# Altium project LimeSDR_Mini_1v3.PrjPcb (part 2 of 4)

## Sheet 06_LMS7002M_Power.SchDoc: LMS7002M power supply
size A3 portrait; Organization: Lime Microsystems; Address1: Surrey Tech Centre; Address2: Guildford GU2 7YG; Address3: Surrey; Address4: United Kingdom; Revision: v1.3; SheetNumber: 6; SheetTotal: 9; PageSetup: Record=PageOptions|CenterHorizontal=True|CenterVertical=True|PrintScale=0.73|XCorrection=1.00|YCorrection=1.00|PrintKind=0|BorderSize=5000000|LeftOffset=0|BottomOffset=0|Orientation=1|PaperLength=2970|PaperWidth=2100|Scale=100|PaperSource=7|PrintQuality=-3|MediaType=1|DitherType=10|PrintScaleMode=1|PaperKind=A4|PaperIndex=9
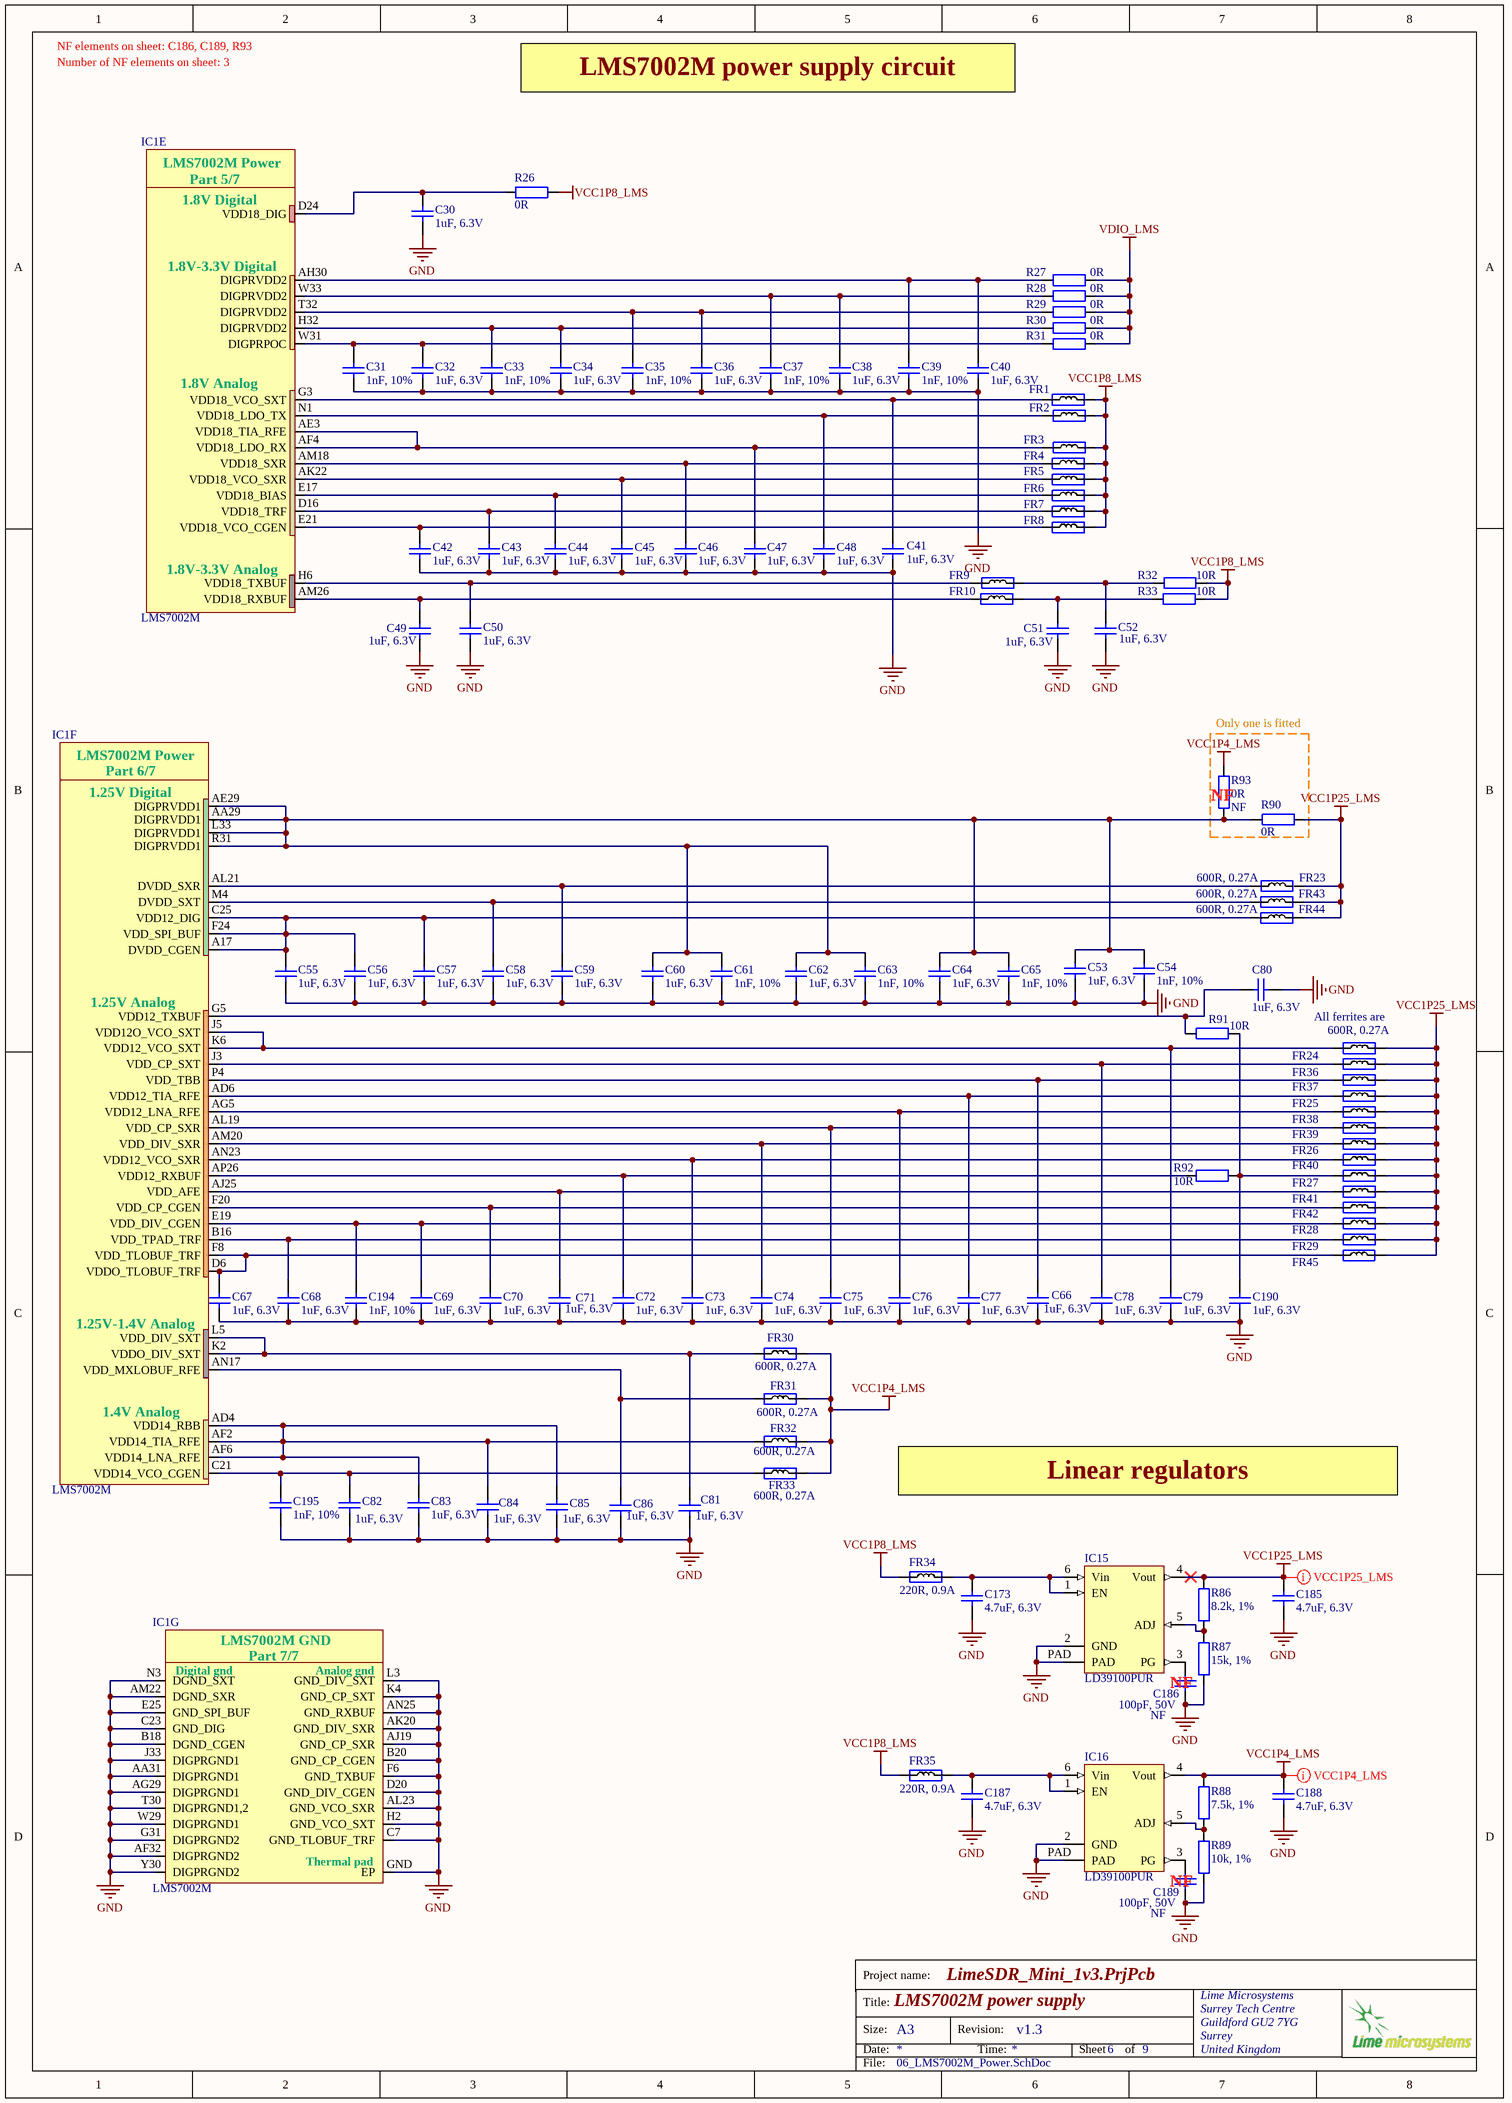
[diagram p5: 06_LMS7002M_Power.SchDoc]

### Parts
C30  1uF, 6.3V  [CAP0201]
C31  1nF, 10%  [CAP0201]
C32  1uF, 6.3V  [CAP0201]
C33  1nF, 10%  [CAP0201]
C34  1uF, 6.3V  [CAP0201]
C35  1nF, 10%  [CAP0201]
C36  1uF, 6.3V  [CAP0201]
C37  1nF, 10%  [CAP0201]
C38  1uF, 6.3V  [CAP0201]
C39  1nF, 10%  [CAP0201]
C40  1uF, 6.3V  [CAP0201]
C41  1uF, 6.3V  [CAP0201]
C42  1uF, 6.3V  [CAP0201]
C43  1uF, 6.3V  [CAP0201]
C44  1uF, 6.3V  [CAP0201]
C45  1uF, 6.3V  [CAP0201]
C46  1uF, 6.3V  [CAP0201]
C47  1uF, 6.3V  [CAP0201]
C48  1uF, 6.3V  [CAP0201]
C49  1uF, 6.3V  [CAP0201]
C50  1uF, 6.3V  [CAP0201]
C51  1uF, 6.3V  [CAP0201]
C52  1uF, 6.3V  [CAP0201]
C53  1uF, 6.3V  [CAP0201]
C54  1nF, 10%  [CAP0201]
C55  1uF, 6.3V  [CAP0201]
C56  1uF, 6.3V  [CAP0201]
C57  1uF, 6.3V  [CAP0201]
C58  1uF, 6.3V  [CAP0201]
C59  1uF, 6.3V  [CAP0201]
C60  1uF, 6.3V  [CAP0201]
C61  1nF, 10%  [CAP0201]
C62  1uF, 6.3V  [CAP0201]
C63  1nF, 10%  [CAP0201]
C64  1uF, 6.3V  [CAP0201]
C65  1nF, 10%  [CAP0201]
C66  1uF, 6.3V  [CAP0201]
C67  1uF, 6.3V  [CAP0201]
C68  1uF, 6.3V  [CAP0201]
C69  1uF, 6.3V  [CAP0201]
C70  1uF, 6.3V  [CAP0201]
C71  1uF, 6.3V  [CAP0201]
C72  1uF, 6.3V  [CAP0201]
C73  1uF, 6.3V  [CAP0201]
C74  1uF, 6.3V  [CAP0201]
C75  1uF, 6.3V  [CAP0201]
C76  1uF, 6.3V  [CAP0201]
C77  1uF, 6.3V  [CAP0201]
C78  1uF, 6.3V  [CAP0201]
C79  1uF, 6.3V  [CAP0201]
C80  1uF, 6.3V  [CAP0201]
C81  1uF, 6.3V  [CAP0201]
C82  1uF, 6.3V  [CAP0201]
C83  1uF, 6.3V  [CAP0201]
C84  1uF, 6.3V  [CAP0201]
C85  1uF, 6.3V  [CAP0201]
C86  1uF, 6.3V  [CAP0201]
C173  4.7uF, 6.3V  [CAP0402]
C185  4.7uF, 6.3V  [CAP0402]
C186  100pF, 50V  Assembly Info: NF  [CAP0402]
C187  4.7uF, 6.3V  [CAP0402]
C188  4.7uF, 6.3V  [CAP0402]
C189  100pF, 50V  Assembly Info: NF  [CAP0402]
C190  1uF, 6.3V  [CAP0201]
C194  1nF, 10%  [CAP0201]
C195  1nF, 10%  [CAP0201]
FR1  600R, 0.27A  [RES0201]  (value not drawn)
FR2  600R, 0.27A  [RES0201]  (value not drawn)
FR3  600R, 0.27A  [RES0201]  (value not drawn)
FR4  600R, 0.27A  [RES0201]  (value not drawn)
FR5  600R, 0.27A  [RES0201]  (value not drawn)
FR6  600R, 0.27A  [RES0201]  (value not drawn)
FR7  600R, 0.27A  [RES0201]  (value not drawn)
FR8  600R, 0.27A  [RES0201]  (value not drawn)
FR9  600R, 0.27A  [RES0201]  (value not drawn)
FR10  600R, 0.27A  [RES0201]  (value not drawn)
FR23  600R, 0.27A  [RES0201]
FR24  600R, 0.27A  [RES0201]
FR25  600R, 0.27A  [RES0201]  (value not drawn)
FR26  600R, 0.27A  [RES0201]  (value not drawn)
FR27  600R, 0.27A  [RES0201]  (value not drawn)
FR28  600R, 0.27A  [RES0201]  (value not drawn)
FR29  600R, 0.27A  [RES0201]  (value not drawn)
FR30  600R, 0.27A  [RES0201]
FR31  600R, 0.27A  [RES0201]
FR32  600R, 0.27A  [RES0201]
FR33  600R, 0.27A  [RES0201]
FR34  220R, 0.9A  [RES0402]
FR35  220R, 0.9A  [RES0402]
FR36  600R, 0.27A  [RES0201]  (value not drawn)
FR37  600R, 0.27A  [RES0201]  (value not drawn)
FR38  600R, 0.27A  [RES0201]  (value not drawn)
FR39  600R, 0.27A  [RES0201]  (value not drawn)
FR40  600R, 0.27A  [RES0201]  (value not drawn)
FR41  600R, 0.27A  [RES0201]  (value not drawn)
FR42  600R, 0.27A  [RES0201]  (value not drawn)
FR43  600R, 0.27A  [RES0201]
FR44  600R, 0.27A  [RES0201]
FR45  600R, 0.27A  [RES0201]  (value not drawn)
IC1  LMS7002M  [LMS7002M_v5]  (parts E,F,G of 7)
IC15  LD39100PUR  [LD39100PUR]
IC16  LD39100PUR  [LD39100PUR]
R26  0R  [RES0201]
R27  0R  [RES0402]
R28  0R  [RES0402]
R29  0R  [RES0402]
R30  0R  [RES0402]
R31  0R  [RES0402]
R32  10R  [RES0201]
R33  10R  [RES0201]
R86  8.2k, 1%  [RES0402]
R87  15k, 1%  [RES0402]
R88  7.5k, 1%  [RES0402]
R89  10k, 1%  [RES0402]
R90  0R  [RES0402]
R91  10R  [RES0201]
R92  10R  [RES0201]
R93  0R  Assembly Info: NF  [RES0402]

### Blocks framed on the sheet
Only one is fitted: R90 R93

### Nets
GND: C30.2 C31.2 C32.2 C33.2 C34.2 C35.2 C36.2 C37.2 C38.2 C39.2 C40.2 C41.2 C42.2 C43.2 C44.2 C45.2 C46.2 C47.2 C48.2 C49.2 C50.2 C51.2 C52.2 C53.2 C54.2 C55.2 C56.2 C57.2 C58.1 C59.2 C60.2 C61.2 C62.2 C63.2 C64.2 C65.2 C66.2 C67.2 C68.2 C69.2 C70.1 C71.2 C72.2 C73.2 C74.2 C75.2 C76.2 C77.1 C78.2 C79.1 C80.2 C81.2 C82.2 C83.2 C84.2 C85.2 C86.2 C173.1 C185.1 C186.1 C187.1 C188.1 C189.1 C190.1 C194.2 C195.2 IC1.AA31(DIGPRGND1) IC1.AF32(DIGPRGND2) IC1.AG29(DIGPRGND1) IC1.AJ19(GND_CP_SXR) IC1.AK20(GND_DIV_SXR) IC1.AL23(GND_VCO_SXR) IC1.AM22(DGND_SXR) IC1.AN25(GND_RXBUF) IC1.B18(DGND_CGEN) IC1.B20(GND_CP_CGEN) IC1.C7(GND_TLOBUF_TRF) IC1.C23(GND_DIG) IC1.D20(GND_DIV_CGEN) IC1.E25(GND_SPI_BUF) IC1.F6(GND_TXBUF) IC1.G31(DIGPRGND2) IC1.GND(EP) IC1.H2(GND_VCO_SXT) IC1.J33(DIGPRGND1) IC1.K4(GND_CP_SXT) IC1.L3(GND_DIV_SXT) IC1.N3(DGND_SXT) IC1.T30(DIGPRGND1,2) IC1.W29(DIGPRGND1) IC1.Y30(DIGPRGND2) IC15.2(GND) IC15.PAD IC16.2(GND) IC16.PAD R87.1 R89.1
VCC1P4_LMS: C188.2 FR30.2 FR31.2 FR32.2 FR33.2 IC16.4(Vout) R88.2 R93.1
VCC1P8_LMS: FR1.2 FR2.1 FR3.1 FR4.2 FR5.2 FR6.2 FR7.2 FR8.2 FR34.1 FR35.1 R26.2 R32.2 R33.1
VCC1P25_LMS: C185.2 FR23.2 FR24.2 FR25.2 FR26.2 FR27.2 FR28.2 FR29.2 FR36.2 FR37.2 FR38.2 FR39.2 FR40.2 FR41.2 FR42.2 FR43.2 FR44.2 FR45.2 IC15.4(Vout) R86.2 R90.1
VDIO_LMS: R27.1 R28.1 R29.1 R30.1 R31.1
NetC30_1: C30.1 IC1.D24(VDD18_DIG) R26.1
NetC31_1: C31.1 C32.1 IC1.W31(DIGPRPOC) R31.2
NetC33_1: C33.1 C34.1 IC1.H32(DIGPRVDD2) R30.2
NetC35_1: C35.1 C36.1 IC1.T32(DIGPRVDD2) R29.2
NetC37_1: C37.1 C38.1 IC1.W33(DIGPRVDD2) R28.2
NetC39_1: C39.1 C40.1 IC1.AH30(DIGPRVDD2) R27.2
NetC41_1: C41.1 FR1.1 IC1.G3(VDD18_VCO_SXT)
NetC42_1: C42.1 FR8.1 IC1.E21(VDD18_VCO_CGEN)
NetC43_1: C43.1 FR7.1 IC1.D16(VDD18_TRF)
NetC44_1: C44.1 FR6.1 IC1.E17(VDD18_BIAS)
NetC45_1: C45.1 FR5.1 IC1.AK22(VDD18_VCO_SXR)
NetC46_1: C46.1 FR4.1 IC1.AM18(VDD18_SXR)
NetC47_1: C47.1 FR3.2 IC1.AE3(VDD18_TIA_RFE) IC1.AF4(VDD18_LDO_RX)
NetC48_1: C48.1 FR2.2 IC1.N1(VDD18_LDO_TX)
NetC49_1: C49.1 FR10.1 IC1.AM26(VDD18_RXBUF)
NetC50_1: C50.1 FR9.2 IC1.H6(VDD18_TXBUF)
NetC51_1: C51.1 FR10.2 R33.2
NetC52_1: C52.1 FR9.1 R32.1
NetC53_1: C53.1 C54.1 C60.1 C61.1 C62.1 C63.1 C64.1 C65.1 IC1.AA29(DIGPRVDD1) IC1.AE29(DIGPRVDD1) IC1.L33(DIGPRVDD1) IC1.R31(DIGPRVDD1) R90.2 R93.2
NetC55_1: C55.1 C56.1 C57.1 FR44.1 IC1.A17(DVDD_CGEN) IC1.C25(VDD12_DIG) IC1.F24(VDD_SPI_BUF)
NetC58_2: C58.2 FR43.1 IC1.M4(DVDD_SXT)
NetC59_1: C59.1 FR23.1 IC1.AL21(DVDD_SXR)
NetC66_1: C66.1 FR37.1 IC1.P4(VDD_TBB)
NetC67_1: C67.1 FR45.1 IC1.D6(VDDO_TLOBUF_TRF) IC1.F8(VDD_TLOBUF_TRF)
NetC68_1: C68.1 FR29.1 IC1.B16(VDD_TPAD_TRF)
NetC69_1: C69.1 C194.1 FR28.1 IC1.E19(VDD_DIV_CGEN)
NetC70_2: C70.2 FR42.1 IC1.F20(VDD_CP_CGEN)
NetC71_1: C71.1 FR41.1 IC1.AJ25(VDD_AFE)
NetC72_1: C72.1 IC1.AP26(VDD12_RXBUF) R92.1
NetC73_1: C73.1 FR40.1 IC1.AN23(VDD12_VCO_SXR)
NetC74_1: C74.1 FR26.1 IC1.AM20(VDD_DIV_SXR)
NetC75_1: C75.1 FR39.1 IC1.AL19(VDD_CP_SXR)
NetC76_1: C76.1 FR38.1 IC1.AG5(VDD12_LNA_RFE)
NetC77_2: C77.2 FR25.1 IC1.AD6(VDD12_TIA_RFE)
NetC78_1: C78.1 FR36.1 IC1.J3(VDD_CP_SXT)
NetC79_2: C79.2 FR24.1 IC1.J5(VDD12O_VCO_SXT) IC1.K6(VDD12_VCO_SXT)
NetC80_1: C80.1 IC1.G5(VDD12_TXBUF) R91.1
NetC81_1: C81.1 FR30.1 IC1.K2(VDDO_DIV_SXT) IC1.L5(VDD_DIV_SXT)
NetC82_1: C82.1 C195.1 FR33.1 IC1.C21(VDD14_VCO_CGEN)
NetC83_1: C83.1 C84.1 C85.1 FR32.1 IC1.AD4(VDD14_RBB) IC1.AF2(VDD14_TIA_RFE) IC1.AF6(VDD14_LNA_RFE)
NetC86_1: C86.1 FR31.1 IC1.AN17(VDD_MXLOBUF_RFE)
NetC173_2: C173.2 FR34.2 IC15.1(EN) IC15.6(Vin)
NetC186_2: C186.2 IC15.3(PG)
NetC187_2: C187.2 FR35.2 IC16.1(EN) IC16.6(Vin)
NetC189_2: C189.2 IC16.3(PG)
NetC190_2: C190.2 FR27.1 R91.2 R92.2
NetIC15_5: IC15.5(ADJ) R86.1 R87.2
NetIC16_5: IC16.5(ADJ) R88.1 R89.2

### Layout directives
net class VCC1P25_LMS: VCC1P25_LMS
net class VCC1P4_LMS: VCC1P4_LMS

### Notes on the sheet
- Number of NF elements on sheet: 3
- NF elements on sheet: C186, C189, R93
- LMS7002M power supply circuit
- (near R93) NF
- (near FR24) All ferrites are
- Linear regulators
- NF
- Project name:
- Title:
- Size:
- Date:
- A3
- Revision:
- Time:
- Sheet
- of
- File:
- (in symbol LMS7002Mr3, part E) LMS7002M Power; Part 5/7; 1.8V Digital; 1.8V-3.3V Digital; 1.8V Analog; 1.8V-3.3V Analog
- (in symbol LMS7002Mr3, part F) LMS7002M Power; Part 6/7; 1.25V Digital; 1.25V Analog; 1.25V-1.4V Analog; 1.4V Analog
- (in symbol LMS7002Mr3, part G) LMS7002M GND; Part 7/7; Digital gnd; Analog gnd; Thermal pad

### Library data of the parts
C30 C32 C34 C36 C38 C40-C53 C55-C60 C62 C64 C66-C86 C190 = Cap_0402: Manufacturer: TDK Corporation; Manufacturer Part Number 1: JMK063ABJ105MP-F; Part Description: 1µF ±20% 6.3V X5R Ceramic Capacitor -55°C ~ 85°C Surface Mount, MLCC 0201 (0603 Metric) 0.024" L x 0.012" W (0.60mm x 0.30mm); Value: 1uF, 20%; Tolerance: ±20%; Capacitance: 1.0µF; Temperature Coefficient: X5R; Supplier 1: Digi-Key; Supplier Part Number 1: 587-5864-2-ND; Applications: General Purpose; Features: -; Lead Style: -; Ratings: -; Thickness (Max): -; Lead Spacing: -; Height - Seated (Max): -; Size / Dimension: 0.024" L x 0.012" W (0.60mm x 0.30mm); Mounting Type: Surface Mount, MLCC; Operating Temperature: -55°C ~ 85°C; Package / Case: 0201 (0603 Metric); Packaging: Cut Tape (CT); Voltage - Rated: 6.3V; Category: Capacitors; RoHS: RoHS Compliant
C31 C33 C35 C37 C39 C54 C61 C63 C65 C194 C195 = Cap_0402: Manufacturer Part Number 1: C0603X7R1E102K030BA; Manufacturer: TDK Corporation; Part Description: 1000pF ±10% 25V X7R Ceramic Capacitor -55°C ~ 125°C Surface Mount, MLCC 0201 (0603 Metric) 0.024" L x 0.012" W (0.60mm x 0.30mm); Voltage - Rated: 25V; Temperature Coefficient: X7R; Capacitance: 1000pF; Value: 1nF, 10%; Supplier 1: Digi-Key; Supplier Part Number 1: 445-7275-1-ND; Features: -; Package / Case: 0201 (0603 Metric); Lead Spacing: -; Mounting Type: Surface Mount, MLCC; Lead Style: -; Height - Seated (Max): -; Operating Temperature: -55°C ~ 125°C; Tolerance: ±10%; Size / Dimension: 0.024" L x 0.012" W (0.60mm x 0.30mm); Applications: General Purpose; Ratings: -; Thickness (Max): 0.013" (0.33mm); RoHS: RoHS Compliant; Packaging: Cut Tape (CT); Category: Capacitors
C173 C185 C187 C188 = Cap_0402: Manufacturer: Murata Electronics North America; Manufacturer Part Number 1: GRM155R60J475ME87D; Part Description: 4.7µF ±20% 6.3V X5R Ceramic Capacitor -55°C ~ 85°C Surface Mount, MLCC 0402 (1005 Metric) 0.039" L x 0.020" W (1.00mm x 0.50mm); Tolerance: ±20%; Capacitance: 4.7µF; Temperature Coefficient: X5R; Lead Style: -; Ratings: -; Height - Seated (Max): -; Thickness (Max): 0.022" (0.55mm); Voltage - Rated: 6.3V; Packaging: Cut Tape (CT); Lead Spacing: -; Category: Capacitors; Supplier Part Number 1: 490-5408-1-ND; Applications: General Purpose; Operating Temperature: -55°C ~ 85°C; Mounting Type: Surface Mount, MLCC; Features: Derating Recommended; RoHS: RoHS Compliant; Supplier 1: Digi-Key; Package / Case: 0402 (1005 Metric); Size / Dimension: 0.039" L x 0.020" W (1.00mm x 0.50mm); Value: 4.7uF, 6.3V
C186 C189 = Cap_0402: Manufacturer Part Number 1: CC0402JRNPO9BN101; Manufacturer: Yageo; Part Description: 100pF ±5% 50V C0G, NP0 Ceramic Capacitor -55°C ~ 125°C Surface Mount, MLCC 0402 (1005 Metric) 0.039" L x 0.020" W (1.00mm x 0.50mm); Temperature Coefficient: C0G, NP0; Tolerance: ±5%; Value: 100pF, 50V; Supplier 1: Digi-Key; Supplier Part Number 1: 311-1024-1-ND; RoHS: RoHS Compliant; Category: Capacitors; Applications: General Purpose; Mounting Type: Surface Mount, MLCC; Capacitance: 100pF; Ratings: -; Packaging: Cut Tape (CT); Voltage - Rated: 50V; Size / Dimension: 0.039" L x 0.020" W (1.00mm x 0.50mm); Height - Seated (Max): -; Package / Case: 0402 (1005 Metric); Operating Temperature: -55°C ~ 125°C; Features: -; Lead Spacing: -; Lead Style: -; Thickness (Max): 0.022" (0.55mm)
FR1-FR10 FR23-FR33 FR36-FR45 = Ferrite: Manufacturer Part Number 1: BK0603TS601-T; Manufacturer: Taiyo Yuden; Part Description: FERRITE BEAD 600 OHM 0201 1LN; DC Resistance (DCR): 750 mOhm Max; Filter Type: Differential Mode - Single; Impedance @ Frequency: 600 Ohm @ 100MHz; Current Rating: 270mA; Value: 600R@100MHz; Supplier 1: Digi-Key; Supplier Part Number 1: 587-3277-1-ND; Size / Dimension: 0.024" L x 0.012" W (0.60mm x 0.30mm); Package / Case: 0201 (0603 Metric); Height (Max): 0.013" (0.33mm); Mounting Type: Surface Mount; Packaging: Cut Tape (CT); RoHS: RoHS Compliant; Category: Filters
FR34 FR35 = Ferrite: Manufacturer: TDK Corporation; Manufacturer Part Number 1: MPZ1005S221ET000; Part Description: FERRITE BEAD 220 OHM 0402 1LN; Impedance @ Frequency: 220 Ohm @ 100MHz; Current Rating: 900mA; DC Resistance (DCR): 220 mOhm Max; Supplier 1: Digi-Key; Package / Case: 0402 (1005 Metric); Category: Filters; Supplier Part Number 1: 445-9329-2-ND; Value: 220R, 0.9A
IC1 = LMS7002Mr3: Schematic symbol revision 3. Default footprint - 0.31mm pad; Manufacturer: Lime Microsystems; Part Description: IC FPRF Transceiver LMS7002M; 261 pin aQFN; Supplier 1: Lime Microsystems; Supplier Part Number 1: LMS7002M; Manufacturer Part Number 1: LMS7002M
IC15 IC16 = LD39100PUR: Manufacturer: STMicroelectronics; Part Description: Linear Voltage Regulator IC Positive Adjustable Output 0.8 V ~ 4.5 V 1A 6-DFN (3x3); Output Configuration: Positive; Output Type: Adjustable; Voltage - Input (Max): 5.5V; Voltage - Output (Min/Fixed): 0.8V; Voltage - Output (Max): 4.6V; Voltage Dropout (Max): 0.4V @ 1A; Current - Output: 1A; Current - Supply: 50µA ~ 300µA; PSRR: 70dB ~ 65dB (1kHz ~ 10kHz); Control Features: Enable, Power Good; Protection Features: Over Current, Over Temperature, Short Circuit; Supplier 1: Digi-Key; Manufacturer Part Number 1: LD39100PUR; RoHS: RoHS Compliant; Category: Integrated Circuits (ICs); Stock 1: 27970; Pricing 1: 1=0.85, 10=0.76, 100=0.5923, 500=0.48926, 1000=0.38625 (USD); Packaging: Cut Tape (CT); Part Status: Active; Operating Temperature: -40°C ~ 125°C; Mounting Type: Surface Mount; Package / Case: 6-VDFN Exposed Pad; Supplier Device Package: 6-DFN (3x3); ComponentLink1URL: http://www.st.com/content/ccc/resource/technical/document/datasheet/72/02/e5/ee/df/36/40/5e/CD00233788.pdf/files/CD00233788.pdf/jcr:content/translations/en.CD00233788.pdf; ComponentLink1Description: http://www.st.com/content/ccc/resource/technical/document/datasheet/72/02/e5/ee/df/36/40/5e/CD00233788.pdf/files/CD00233788.pdf/jcr:content/translations/en.CD00233788.pdf; Supplier Part Number 1: 497-11013-1-ND
R26 = Res_0402: Manufacturer Part Number 1: RC0201FR-070RL; Manufacturer: Rohm Semiconductor; Part Description: RES SMD 0.0OHM JUMPER 1/20W 0201; Resistance (Ohms): 0.0; Power (Watts): 0.05W, 1/20W; Tolerance: Jumper; Value: 0R; Supplier 1: Digi-Key; Supplier Part Number 1: 311-0.0MCT-ND; Number of Terminations: 2; Operating Temperature: -55°C ~ 125°C; Package / Case: 0201 (0603 Metric); Height: 0.010" (0.26mm); Supplier Device Package: 0201 (0603 Metric); Size / Dimension: 0.024" L x 0.012" W (0.60mm x 0.30mm); Temperature Coefficient: -; Category: Resistors; Features: -; RoHS: RoHS Compliant; Composition: Thick Film; Packaging: Cut Tape (CT)
R27-R31 R90 R93 = Res_0402: Manufacturer Part Number 1: RC0402JR-070RL; Manufacturer: Yageo; Part Description: RES SMD 0.0OHM JUMPER 1/16W 0402; Resistance (Ohms): 0.0; Tolerance: Jumper; Power (Watts): 0.063W, 1/16W; Value: 0R; Supplier 1: Digi-Key; Supplier Part Number 1: 311-0.0JRTR-ND; Category: Resistors; Temperature Coefficient: -; Features: Moisture Resistant; Supplier Device Package: 0402; Height: 0.016" (0.40mm); Package / Case: 0402 (1005 Metric); Operating Temperature: -55°C ~ 155°C; Size / Dimension: 0.039" L x 0.020" W (1.00mm x 0.50mm); Composition: Thick Film; Packaging: Tape & Reel (TR); Number of Terminations: 2; RoHS: RoHS Compliant
R32 R33 = Res_0402: Manufacturer: Panasonic Electronic Components; Manufacturer Part Number: ERJ-1GEF10R0C; Part Description: RES SMD 10 OHM 1% 1/20W 0201; Power (Watts): 0.05W, 1/20W; Resistance (Ohms): 10; Tolerance: ±1%; Temperature Coefficient: ±200ppm/°C; Value: 10R; Supplier 1: Digi-Key; Supplier Part Number 1: P10.0ABCT-ND; Package / Case: 0201 (0603 Metric); Height: 0.010" (0.26mm); Supplier Device Package: 0201; Packaging: Cut Tape (CT); Composition: Thick Film; Category: Resistors; Number of Terminations: 2; Size / Dimension: 0.024" L x 0.012" W (0.60mm x 0.30mm); Operating Temperature: -55°C ~ 125°C; Features: -; RoHS: RoHS Compliant
R86 = Res_0402: Manufacturer: Yageo; Part Description: RES SMD 8.2K OHM 1% 1/16W 0402; Manufacturer Part Number 1: RC0402FR-078K2L; Power (Watts): 0.063W, 1/16W; Temperature Coefficient: ±100ppm/°C; Value: 8.2k, 1%; Supplier 1: Digi-Key; Supplier Device Package: 0402; Package / Case: 0402 (1005 Metric); Height: 0.016" (0.40mm); Supplier Part Number 1: 311-8.20KLRCT-ND; Number of Terminations: 2; Operating Temperature: -55°C ~ 155°C; Resistance (Ohms): 8.2k; Size / Dimension: 0.039" L x 0.020" W (1.00mm x 0.50mm); Composition: Thick Film; Category: Resistors; Tolerance: ±1%; Features: Moisture Resistant; RoHS: RoHS Compliant; Packaging: Cut Tape (CT)
R87 = Res_0402: Manufacturer: Yageo; Manufacturer Part Number 1: RC0402FR-0715KL; Part Description: RES SMD 15K OHM 1% 1/16W 0402; Temperature Coefficient: ±100ppm/°C; Power (Watts): 0.063W, 1/16W; Value: 15k, 1%; Category: Resistors; Number of Terminations: 2; RoHS: RoHS Compliant; Features: Moisture Resistant; Operating Temperature: -55°C ~ 155°C; Tolerance: ±1%; Composition: Thick Film; Resistance (Ohms): 15k; Failure Rate: -; Height - Seated (Max): 0.016" (0.40mm); Packaging: Cut Tape (CT); Supplier Device Package: 0402; Size / Dimension: 0.039" L x 0.020" W (1.00mm x 0.50mm); Package / Case: 0402 (1005 Metric); Part Status: Active; Supplier 1: Digi-Key; Supplier Part Number 1: 311-15.0KLRCT-ND
R88 = Res_0402: Manufacturer: Yageo; Manufacturer Part Number 1: RC0402FR-077K5L; Part Description: ±1% 0.063W, 1/16W Chip Resistor 0402 (1005 Metric) Automotive AEC-Q200, Moisture Resistant Thick Film; Power (Watts): 0.063W, 1/16W; Temperature Coefficient: ±100ppm/°C; Value: 7.5k, 1%; Operating Temperature: -55°C ~ 155°C; Height - Seated (Max): 0.016" (0.40mm); Supplier 1: Digi-Key; Composition: Thick Film; Packaging: Cut Tape (CT); Tolerance: ±1%; Category: Resistors; Part Status: Active; Failure Rate: -; Supplier Device Package: 0402; Features: Moisture Resistant; Supplier Part Number 1: YAG3512CT-ND; RoHS: RoHS Compliant; Package / Case: 0402 (1005 Metric); Size / Dimension: 0.039" L x 0.020" W (1.00mm x 0.50mm)
R89 = Res_0402: Manufacturer: Yageo; Manufacturer Part Number 1: RC0402FR-0710KL; Part Description: RES SMD 10K OHM 1% 1/16W 0402; Temperature Coefficient: ±100ppm/°C; Power (Watts): 0.063W, 1/16W; Value: 10k, 1%; Supplier 1: Digi-Key; Supplier Part Number 1: 311-10.0KLRTR-ND; Resistance (Ohms): 10k; Packaging: Tape & Reel (TR); RoHS: RoHS Compliant; Package / Case: 0402 (1005 Metric); Tolerance: ±1%; Operating Temperature: -55°C ~ 155°C; Size / Dimension: 0.039" L x 0.020" W (1.00mm x 0.50mm); Number of Terminations: 2; Category: Resistors; Height: 0.016" (0.40mm); Supplier Device Package: 0402; Features: Moisture Resistant; Composition: Thick Film
R91 R92 = Res_0402: Manufacturer: Panasonic Electronic Components; Part Description: RES SMD 10 OHM 1% 1/20W 0201; Manufacturer Part Number 1: ERJ-1GEF10R0C; Power (Watts): 0.05W, 1/20W; Resistance (Ohms): 10; Tolerance: ±1%; Temperature Coefficient: ±200ppm/°C; Value: 10R; Supplier 1: Digi-Key; Supplier Part Number 1: P10.0ABCT-ND; Package / Case: 0201 (0603 Metric); Height: 0.010" (0.26mm); Supplier Device Package: 0201; Packaging: Cut Tape (CT); Composition: Thick Film; Category: Resistors; Number of Terminations: 2; Size / Dimension: 0.024" L x 0.012" W (0.60mm x 0.30mm); Operating Temperature: -55°C ~ 125°C; Features: -; RoHS: RoHS Compliant

## Sheet 07_FPGA.SchDoc: FPGA
size A3; Organization: Lime Microsystems; Address1: Surrey Tech Centre; Address2: Guildford GU2 7YG; Address3: Surrey; Address4: United Kingdom; Revision: v1.3; SheetNumber: 7; SheetTotal: 9
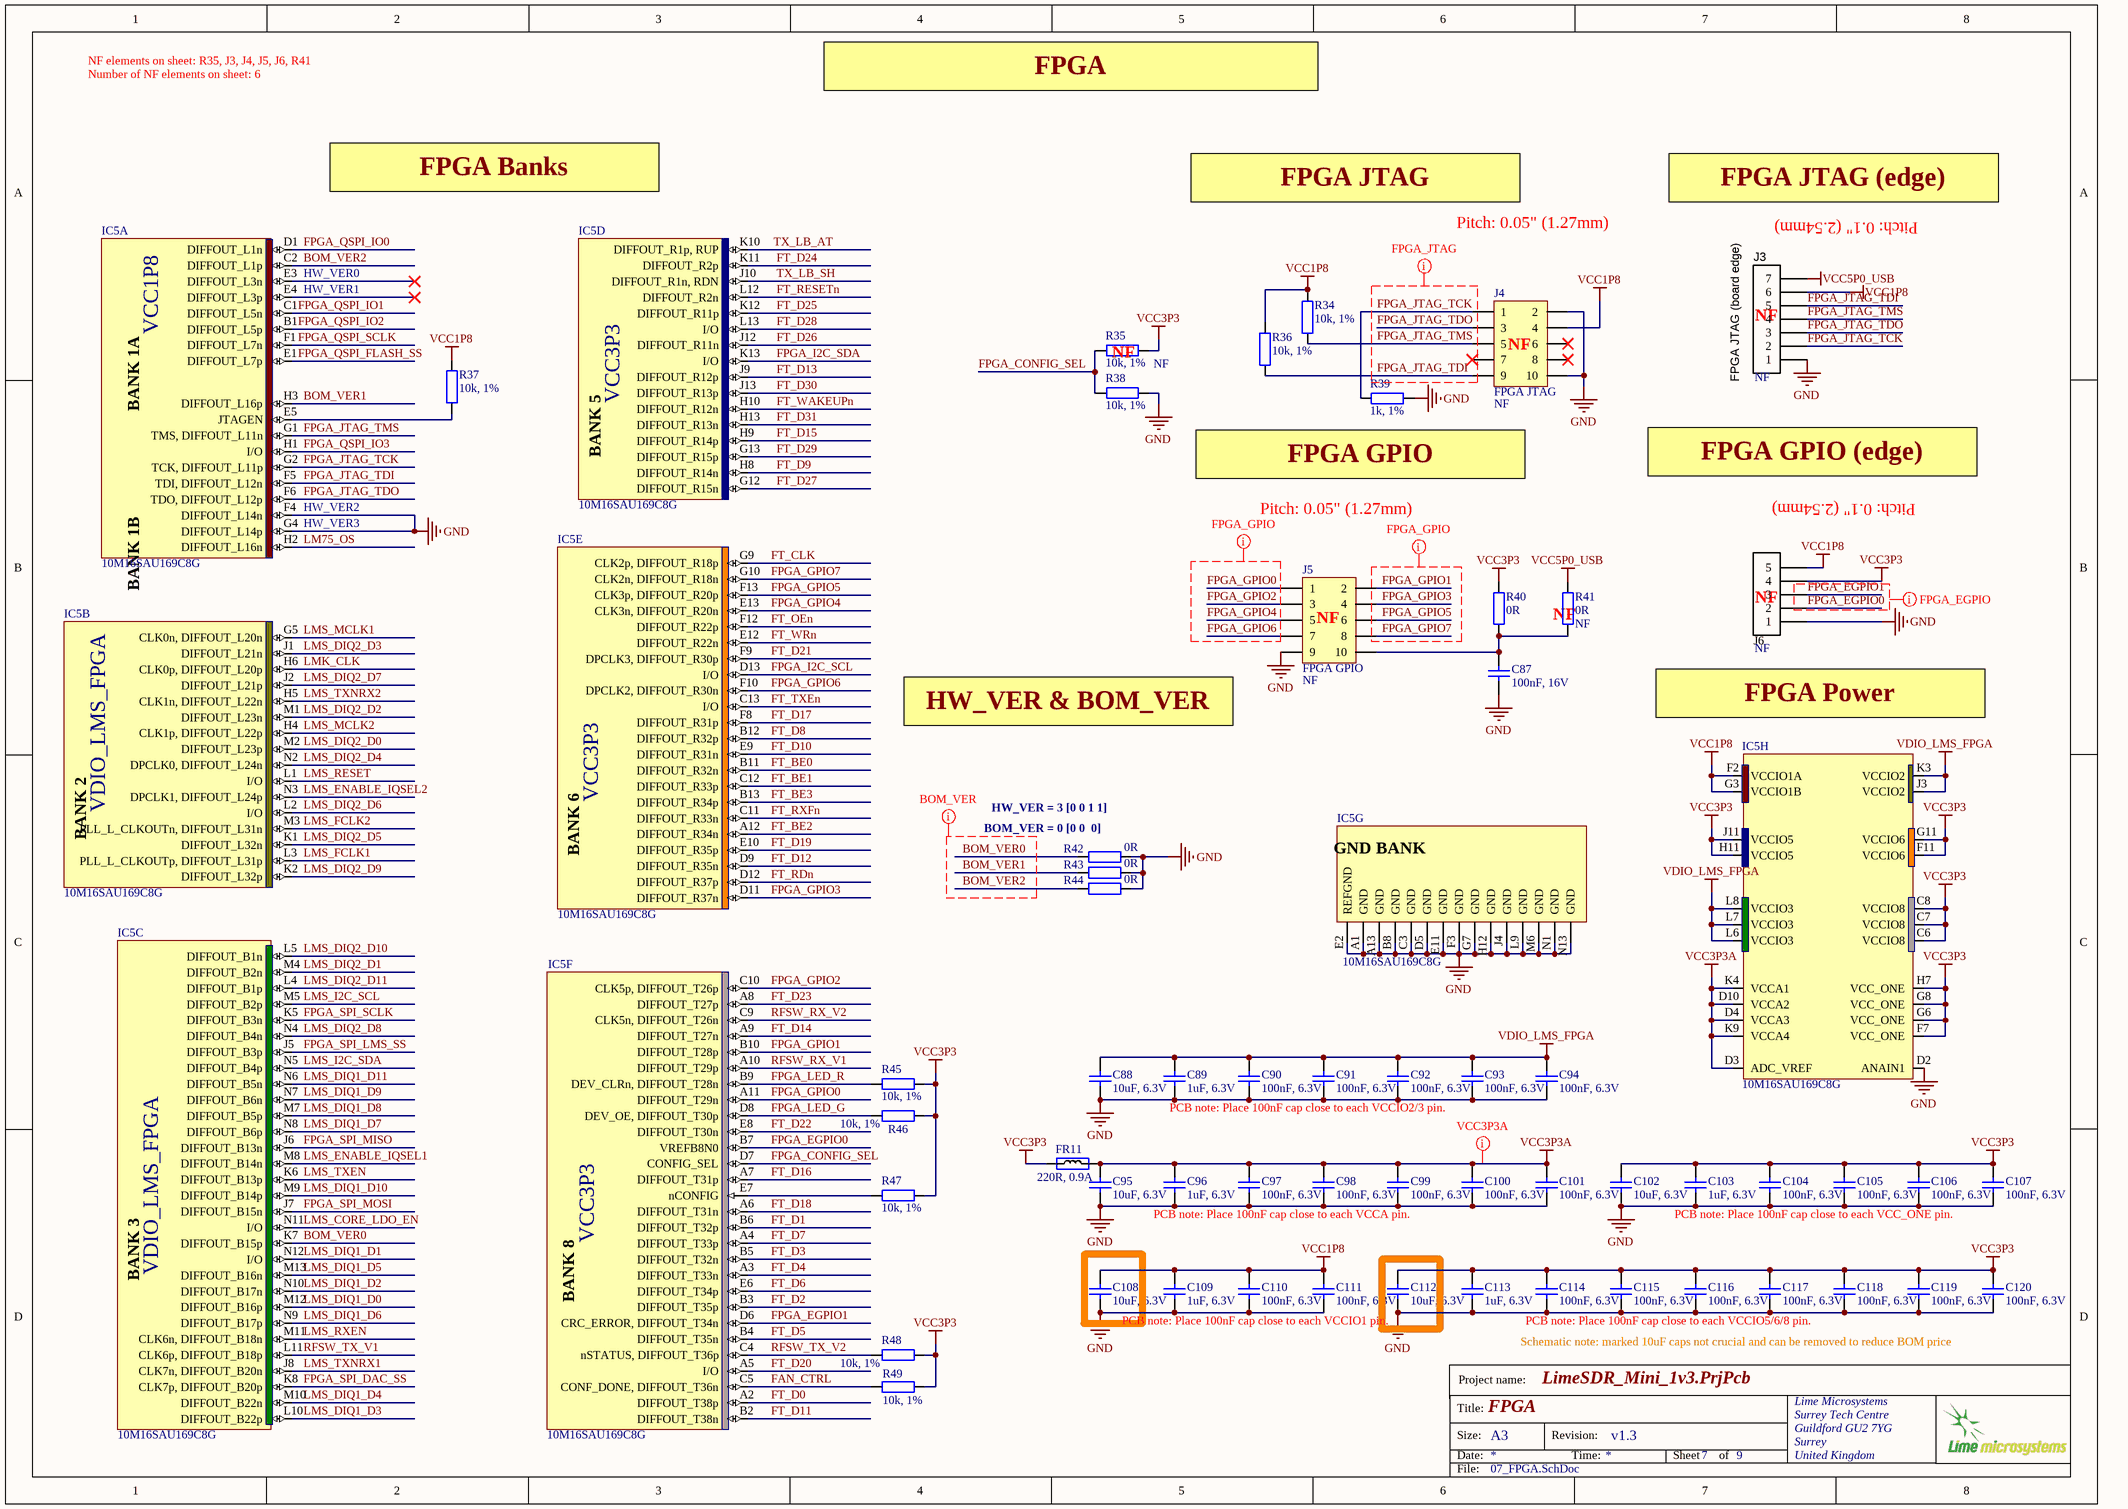
[diagram p6: 07_FPGA.SchDoc]

### Parts
C87  100nF, 16V  [CAP0402]
C88  10uF, 6.3V  [CAP0603]
C89  1uF, 6.3V  [CAP0201]
C90  100nF, 6.3V  [CAP0201]
C91  100nF, 6.3V  [CAP0201]
C92  100nF, 6.3V  [CAP0201]
C93  100nF, 6.3V  [CAP0201]
C94  100nF, 6.3V  [CAP0201]
C95  10uF, 6.3V  [CAP0603]
C96  1uF, 6.3V  [CAP0201]
C97  100nF, 6.3V  [CAP0201]
C98  100nF, 6.3V  [CAP0201]
C99  100nF, 6.3V  [CAP0201]
C100  100nF, 6.3V  [CAP0201]
C101  100nF, 6.3V  [CAP0201]
C102  10uF, 6.3V  [CAP0603]
C103  1uF, 6.3V  [CAP0201]
C104  100nF, 6.3V  [CAP0201]
C105  100nF, 6.3V  [CAP0201]
C106  100nF, 6.3V  [CAP0201]
C107  100nF, 6.3V  [CAP0201]
C108  10uF, 6.3V  [CAP0603]
C109  1uF, 6.3V  [CAP0201]
C110  100nF, 6.3V  [CAP0201]
C111  100nF, 6.3V  [CAP0201]
C112  10uF, 6.3V  [CAP0603]
C113  1uF, 6.3V  [CAP0201]
C114  100nF, 6.3V  [CAP0201]
C115  100nF, 6.3V  [CAP0201]
C116  100nF, 6.3V  [CAP0201]
C117  100nF, 6.3V  [CAP0201]
C118  100nF, 6.3V  [CAP0201]
C119  100nF, 6.3V  [CAP0201]
C120  100nF, 6.3V  [CAP0201]
FR11  220R, 0.9A  [RES0402]
IC5  10M16SAU169C8G  [10M16SAU169C8G]  (parts A,B,C,D,E,F,G,H of 8)
J3  FPGA JTAG (board edge)  Assembly Info: NF  [Header7x1_TH_v2]
J4  FPGA JTAG  Assembly Info: NF  [SWD_10_pin]
J5  FPGA GPIO  Assembly Info: NF  [SWD_10_pin]
J6  Assembly Info: NF  [Header5x1_TH_v2]  (hidden comment: FPGA EGPIO (board edge))
R34  10k, 1%  [RES0402]
R35  10k, 1%  Assembly Info: NF  [RES0402]
R36  10k, 1%  [RES0402]
R37  10k, 1%  [RES0402]
R38  10k, 1%  [RES0402]
R39  1k, 1%  [RES0402]
R40  0R  [RES0402]
R41  0R  Assembly Info: NF  [RES0402]
R42  0R  [RES0402]
R43  0R  [RES0402]
R44  0R  [RES0402]
R45  10k, 1%  [RES0402]
R46  10k, 1%  [RES0402]
R47  10k, 1%  [RES0402]
R48  10k, 1%  [RES0402]
R49  10k, 1%  [RES0402]

### Nets
GND: C87.1 C88.1 C89.2 C90.2 C91.2 C92.2 C93.2 C94.2 C95.1 C96.2 C97.2 C98.2 C99.2 C100.2 C101.2 C102.1 C103.2 C104.2 C105.2 C106.2 C107.2 C108.1 C109.2 C110.2 C111.2 C112.1 C113.2 C114.2 C115.2 C116.2 C117.2 C118.2 C119.2 C120.2 IC5.A1(GND) IC5.A13(GND) IC5.B8(GND) IC5.C3(GND) IC5.D2(ANAIN1) IC5.D5(GND) IC5.E2(REFGND) IC5.E11(GND) IC5.F3(GND) IC5.F4(DIFFOUT_L14n) IC5.G4(DIFFOUT_L14p) IC5.G7(GND) IC5.H12(GND) IC5.J4(GND) IC5.L9(GND) IC5.M6(GND) IC5.N1(GND) IC5.N13(GND) J3.1 J4.2 J4.10 J5.9 J6.1 R38.1 R39.2 R42.1 R43.1 R44.1
VCC1P8: C108.2 C109.1 C110.1 C111.1 IC5.F2(VCCIO1A) IC5.G3(VCCIO1B) J3.6 J4.4 J6.5 R34.2 R36.2 R37.1
VCC3P3: C102.2 C103.1 C104.1 C105.1 C106.1 C107.1 C112.2 C113.1 C114.1 C115.1 C116.1 C117.1 C118.1 C119.1 C120.1 FR11.1 IC5.C6(VCCIO8) IC5.C7(VCCIO8) IC5.C8(VCCIO8) IC5.F7(VCC_ONE) IC5.F11(VCCIO6) IC5.G6(VCC_ONE) IC5.G8(VCC_ONE) IC5.G11(VCCIO6) IC5.H7(VCC_ONE) IC5.H11(VCCIO5) IC5.J11(VCCIO5) J6.4 R35.1 R40.1 R45.1 R46.1 R47.1 R48.1 R49.1
VCC3P3A: C95.2 C96.1 C97.1 C98.1 C99.1 C100.1 C101.1 FR11.2 IC5.D3(ADC_VREF) IC5.D4(VCCA3) IC5.D10(VCCA2) IC5.K4(VCCA1) IC5.K9(VCCA4)
VCC5P0_USB: J3.7 R41.1
VDIO_LMS_FPGA: C88.2 C89.1 C90.1 C91.1 C92.1 C93.1 C94.1 IC5.J3(VCCIO2) IC5.K3(VCCIO2) IC5.L6(VCCIO3) IC5.L7(VCCIO3) IC5.L8(VCCIO3)
BOM_VER0: IC5.K7(DIFFOUT_B15p) R42.2
BOM_VER1: IC5.H3(DIFFOUT_L16p) R43.2
BOM_VER2: IC5.C2(DIFFOUT_L1p) R44.2
FAN_CTRL: IC5.C5(CONF_DONE,_DIFFOUT_T36n) R49.2
FPGA_CONFIG_SEL: IC5.D7(CONFIG_SEL) R35.2 R38.2
FPGA_EGPIO0: IC5.B7(VREFB8N0) J6.2
FPGA_EGPIO1: IC5.D6(CRC_ERROR,_DIFFOUT_T34n) J6.3
FPGA_GPIO0: IC5.A11(DIFFOUT_T29n) J5.1
FPGA_GPIO1: IC5.B10(DIFFOUT_T28p) J5.2
FPGA_GPIO2: IC5.C10(CLK5p,_DIFFOUT_T26p) J5.3
FPGA_GPIO3: IC5.D11(DIFFOUT_R37n) J5.4
FPGA_GPIO4: IC5.E13(CLK3n,_DIFFOUT_R20n) J5.5
FPGA_GPIO5: IC5.F13(CLK3p,_DIFFOUT_R20p) J5.6
FPGA_GPIO6: IC5.F10(DPCLK2,_DIFFOUT_R30n) J5.7
FPGA_GPIO7: IC5.G10(CLK2n,_DIFFOUT_R18n) J5.8
FPGA_I2C_SCL: IC5.D13(I/O)
FPGA_I2C_SDA: IC5.K13(I/O)
FPGA_JTAG_TCK: IC5.G2(TCK,_DIFFOUT_L11p) J3.2 J4.1 R39.1
FPGA_JTAG_TDI: IC5.F5(TDI,_DIFFOUT_L12n) J3.5 J4.9 R36.1
FPGA_JTAG_TDO: IC5.F6(TDO,_DIFFOUT_L12p) J3.3 J4.3
FPGA_JTAG_TMS: IC5.G1(TMS,_DIFFOUT_L11n) J3.4 J4.5 R34.1
FPGA_LED_G: IC5.D8(DEV_OE,_DIFFOUT_T30p) R46.2
FPGA_LED_R: IC5.B9(DEV_CLRn,_DIFFOUT_T28n) R45.2
FPGA_QSPI_FLASH_SS: IC5.E1(DIFFOUT_L7p)
FPGA_QSPI_IO0: IC5.D1(DIFFOUT_L1n)
FPGA_QSPI_IO1: IC5.C1(DIFFOUT_L5n)
FPGA_QSPI_IO2: IC5.B1(DIFFOUT_L5p)
FPGA_QSPI_IO3: IC5.H1(I/O)
FPGA_QSPI_SCLK: IC5.F1(DIFFOUT_L7n)
FPGA_SPI_DAC_SS: IC5.K8(CLK7p,_DIFFOUT_B20p)
FPGA_SPI_LMS_SS: IC5.J5(DIFFOUT_B3p)
FPGA_SPI_MISO: IC5.J6(DIFFOUT_B13n)
FPGA_SPI_MOSI: IC5.J7(DIFFOUT_B15n)
FPGA_SPI_SCLK: IC5.K5(DIFFOUT_B3n)
FT_BE0: IC5.B11(DIFFOUT_R32n)
FT_BE1: IC5.C12(DIFFOUT_R33p)
FT_BE2: IC5.A12(DIFFOUT_R34n)
FT_BE3: IC5.B13(DIFFOUT_R34p)
FT_CLK: IC5.G9(CLK2p,_DIFFOUT_R18p)
FT_D0: IC5.A2(DIFFOUT_T38p)
FT_D1: IC5.B6(DIFFOUT_T32p)
FT_D2: IC5.B3(DIFFOUT_T35p)
FT_D3: IC5.B5(DIFFOUT_T32n)
FT_D4: IC5.A3(DIFFOUT_T33n)
FT_D5: IC5.B4(DIFFOUT_T35n)
FT_D6: IC5.E6(DIFFOUT_T34p)
FT_D7: IC5.A4(DIFFOUT_T33p)
FT_D8: IC5.B12(DIFFOUT_R32p)
FT_D9: IC5.H8(DIFFOUT_R14n)
FT_D10: IC5.E9(DIFFOUT_R31n)
FT_D11: IC5.B2(DIFFOUT_T38n)
FT_D12: IC5.D9(DIFFOUT_R35n)
FT_D13: IC5.J9(DIFFOUT_R12p)
FT_D14: IC5.A9(DIFFOUT_T27n)
FT_D15: IC5.H9(DIFFOUT_R14p)
FT_D16: IC5.A7(DIFFOUT_T31p)
FT_D17: IC5.F8(DIFFOUT_R31p)
FT_D18: IC5.A6(DIFFOUT_T31n)
FT_D19: IC5.E10(DIFFOUT_R35p)
FT_D20: IC5.A5(I/O)
FT_D21: IC5.F9(DPCLK3,_DIFFOUT_R30p)
FT_D22: IC5.E8(DIFFOUT_T30n)
FT_D23: IC5.A8(DIFFOUT_T27p)
FT_D24: IC5.K11(DIFFOUT_R2p)
FT_D25: IC5.K12(DIFFOUT_R11p)
FT_D26: IC5.J12(DIFFOUT_R11n)
FT_D27: IC5.G12(DIFFOUT_R15n)
FT_D28: IC5.L13(I/O)
FT_D29: IC5.G13(DIFFOUT_R15p)
FT_D30: IC5.J13(DIFFOUT_R13p)
FT_D31: IC5.H13(DIFFOUT_R13n)
FT_OEn: IC5.F12(DIFFOUT_R22p)
FT_RDn: IC5.D12(DIFFOUT_R37p)
FT_RESETn: IC5.L12(DIFFOUT_R2n)
FT_RXFn: IC5.C11(DIFFOUT_R33n)
FT_TXEn: IC5.C13(I/O)
FT_WAKEUPn: IC5.H10(DIFFOUT_R12n)
FT_WRn: IC5.E12(DIFFOUT_R22n)
LM75_OS: IC5.H2(DIFFOUT_L16n)
LMK_CLK: IC5.H6(CLK0p,_DIFFOUT_L20p)
LMS_CORE_LDO_EN: IC5.N11(I/O)
LMS_DIQ1_D0: IC5.M12(DIFFOUT_B16p)
LMS_DIQ1_D1: IC5.N12(I/O)
LMS_DIQ1_D2: IC5.N10(DIFFOUT_B17n)
LMS_DIQ1_D3: IC5.L10(DIFFOUT_B22p)
LMS_DIQ1_D4: IC5.M10(DIFFOUT_B22n)
LMS_DIQ1_D5: IC5.M13(DIFFOUT_B16n)
LMS_DIQ1_D6: IC5.N9(DIFFOUT_B17p)
LMS_DIQ1_D7: IC5.N8(DIFFOUT_B6p)
LMS_DIQ1_D8: IC5.M7(DIFFOUT_B5p)
LMS_DIQ1_D9: IC5.N7(DIFFOUT_B6n)
LMS_DIQ1_D10: IC5.M9(DIFFOUT_B14p)
LMS_DIQ1_D11: IC5.N6(DIFFOUT_B5n)
LMS_DIQ2_D0: IC5.M2(DIFFOUT_L23p)
LMS_DIQ2_D1: IC5.M4(DIFFOUT_B2n)
LMS_DIQ2_D2: IC5.M1(DIFFOUT_L23n)
LMS_DIQ2_D3: IC5.J1(DIFFOUT_L21n)
LMS_DIQ2_D4: IC5.N2(DPCLK0,_DIFFOUT_L24n)
LMS_DIQ2_D5: IC5.K1(DIFFOUT_L32n)
LMS_DIQ2_D6: IC5.L2(I/O)
LMS_DIQ2_D7: IC5.J2(DIFFOUT_L21p)
LMS_DIQ2_D8: IC5.N4(DIFFOUT_B4n)
LMS_DIQ2_D9: IC5.K2(DIFFOUT_L32p)
LMS_DIQ2_D10: IC5.L5(DIFFOUT_B1n)
LMS_DIQ2_D11: IC5.L4(DIFFOUT_B1p)
LMS_ENABLE_IQSEL1: IC5.M8(DIFFOUT_B14n)
LMS_ENABLE_IQSEL2: IC5.N3(DPCLK1,_DIFFOUT_L24p)
LMS_FCLK1: IC5.L3(PLL_L_CLKOUTp,_DIFFOUT_L31p)
LMS_FCLK2: IC5.M3(PLL_L_CLKOUTn,_DIFFOUT_L31n)
LMS_I2C_SCL: IC5.M5(DIFFOUT_B2p)
LMS_I2C_SDA: IC5.N5(DIFFOUT_B4p)
LMS_MCLK1: IC5.G5(CLK0n,_DIFFOUT_L20n)
LMS_MCLK2: IC5.H4(CLK1p,_DIFFOUT_L22p)
LMS_RESET: IC5.L1(I/O)
LMS_RXEN: IC5.M11(CLK6n,_DIFFOUT_B18n)
LMS_TXEN: IC5.K6(DIFFOUT_B13p)
LMS_TXNRX1: IC5.J8(CLK7n,_DIFFOUT_B20n)
LMS_TXNRX2: IC5.H5(CLK1n,_DIFFOUT_L22n)
RFSW_RX_V1: IC5.A10(DIFFOUT_T29p)
RFSW_RX_V2: IC5.C9(CLK5n,_DIFFOUT_T26n)
RFSW_TX_V1: IC5.L11(CLK6p,_DIFFOUT_B18p)
RFSW_TX_V2: IC5.C4(nSTATUS,_DIFFOUT_T36p) R48.2
TX_LB_AT: IC5.K10(DIFFOUT_R1p,_RUP)
TX_LB_SH: IC5.J10(DIFFOUT_R1n,_RDN)
NetC87_2: C87.2 J5.10 R40.2 R41.2
NetIC5_E5: IC5.E5(JTAGEN) R37.2
NetIC5_E7: IC5.E7(nCONFIG) R47.2

Not connected (* = marked no-connect by the designer): IC5 E3(DIFFOUT_L3n)* E4(DIFFOUT_L3p)*; J4 6* 7* 8*

### Layout directives
net class FPGA_JTAG: FPGA_JTAG_TCK, FPGA_JTAG_TDI, FPGA_JTAG_TDO, FPGA_JTAG_TMS
net class VCC3P3A: VCC3P3A
net class FPGA_GPIO: FPGA_GPIO0, FPGA_GPIO1, FPGA_GPIO2, FPGA_GPIO3, FPGA_GPIO4, FPGA_GPIO5, FPGA_GPIO6, FPGA_GPIO7
net class FPGA_EGPIO: FPGA_EGPIO0, FPGA_EGPIO1
net class BOM_VER: BOM_VER0, BOM_VER1, BOM_VER2

### Notes on the sheet
- NF elements on sheet: R35, J3, J4, J5, J6, R41
- Number of NF elements on sheet: 6
- FPGA
- FPGA Banks
- FPGA JTAG
- Pitch: 0.05" (1.27mm)
- FPGA JTAG (edge)
- (near J3) Pitch: 0.1" (2.54mm)
- (near IC5) HW_VER0
- (near IC5) HW_VER1
- (near J3) NF
- VCC1P8
- (near R35) NF
- (near J4) NF
- VCC3P3
- (near IC5) HW_VER2
- (near R39) FPGA GPIO
- FPGA GPIO (edge)
- (near J6) Pitch: 0.1" (2.54mm)
- (near IC5) HW_VER3
- (near J5) NF
- (near R41) NF
- (near J6) NF
- HW_VER & BOM_VER
- FPGA Power
- VDIO_LMS_FPGA
- (near R42) BOM_VER = 0 [0 0  0]
- HW_VER = 3 [0 0 1 1]
- PCB note: Place 100nF cap close to each VCCIO2/3 pin.
- PCB note: Place 100nF cap close to each VCCA pin.
- PCB note: Place 100nF cap close to each VCC_ONE pin.
- PCB note: Place 100nF cap close to each VCCIO1 pin.
- PCB note: Place 100nF cap close to each VCCIO5/6/8 pin.
- Schematic note: marked 10uF caps not crucial and can be removed to reduce BOM price
- Project name:
- Title:
- Size:
- Date:
- A3
- Revision:
- Time:
- Sheet
- of
- File:
- (in symbol 10M16SAU169C8G, part A) BANK 1A; BANK 1B
- (in symbol 10M16SAU169C8G, part B) BANK 2
- (in symbol 10M16SAU169C8G, part C) BANK 3
- (in symbol 10M16SAU169C8G, part D) BANK 5
- (in symbol 10M16SAU169C8G, part E) BANK 6
- (in symbol 10M16SAU169C8G, part F) BANK 8
- (in symbol 10M16SAU169C8G, part G) GND BANK

### Library data of the parts
C87 = Cap_0402: Manufacturer: Murata Electronics; Manufacturer Part Number: GRM155R71C104KA88D; Part Description: 0.10µF ±10% 16V X7R Ceramic Capacitor -55°C ~ 125°C Surface Mount, MLCC 0402 (1005 Metric) 0.039" L x 0.020" W (1.00mm x 0.50mm); Tolerance: 10 %; Type: General Purpose MLCC; Capacitance: 0.1 uF; Case Length: 1 mm; Dielectric: X7R; Case Height: 0.5 mm; Temperature Coefficient / Code: +/- 15 %; Value: 100nF, 16V; Supplier 1: Mouser; Supplier Part Number 1: 81-GRM155R71C104KA88; Case Code - in: 0402; RoHS: RoHS Compliant; Operating Temperature Range: - 55 C to + 125 C; Series: GRM; Termination Style: SMD/SMT; Package / Case: 0402 (1005 metric); Voltage Rating DC: 16 V; Maximum Operating Temperature: + 125 C; Case Code - mm: 1005; Minimum Operating Temperature: - 55 C; Product Category: Low & Medium Capacitance SMD Ceramic Chip Capacitors; Packaging: Reel; Product: General Type MLCCs; Category: Multilayer Ceramic Capacitors MLCC - SMD/SMT; Brand: Murata Electronics; Case Width: 0.5 mm; RoHS - Mouser: Y; Standard Pack Qty: 10000; Minimum Order Quantity: 1; Reeling: True; Manufacturer Part Number 1: GRM155R71C104KA88D
C88 C95 C102 C108 C112 = Cap_0603: Manufacturer Part Number 1: CC0603MRX5R5BB106; Manufacturer: Yageo; Part Description: 10µF ±20% 6.3V X5R Ceramic Capacitor -55°C ~ 85°C Surface Mount, MLCC 0603 (1608 Metric) 0.063" L x 0.031" W (1.60mm x 0.80mm); Capacitance: 10µF; Tolerance: ±20%; Supplier 1: Digi-Key; Supplier Part Number 1: 311-1448-2-ND; Package / Case: 0603 (1608 Metric); Category: Capacitors; Voltage - Rated: 6.3V; Value: 10uF, 6.3V
C89 C96 C103 C109 C113 = Cap_0402: as C30 on sheet 06_LMS7002M_Power; Supplier 1: Digi-Key; Supplier Part Number 1: 587-5864-2-ND; Applications: General Purpose; Features: -; Lead Style: -; Ratings: -; Thickness (Max): -; Lead Spacing: -; Height - Seated (Max): -; Size / Dimension: 0.024" L x 0.012" W (0.60mm x 0.30mm); Mounting Type: Surface Mount, MLCC; Operating Temperature: -55°C ~ 85°C; Package / Case: 0201 (0603 Metric); Packaging: Cut Tape (CT); Voltage - Rated: 6.3V; Category: Capacitors; RoHS: RoHS Compliant
C90-C94 C97-C101 C104-C107 C110 C111 C114-C120 = Cap_0402: Manufacturer: Murata; Manufacturer Part Number 1: GRT033C81A104KE01D; Part Description: 0.10µF ±10% 6.3V X6S Ceramic Capacitor -55°C ~ 105°C Surface Mount, MLCC 0201 (0603 Metric) 0.024" L x 0.012" W (0.60mm x 0.30mm); Capacitance: 0.1 uF; Dielectric: X6S; Brand: Murata Electronics; Type: Voltage and Temperature Derating Recommended Product; Voltage Rating DC: 6.3 VDC; Product Status: New Product; Tolerance: 10 %; Value: 100nF, 6.3V; Package / Case: 0201 (0603 metric); Width: 0.3 mm; Minimum Order Quantity: 1; Category: Multilayer Ceramic Capacitors MLCC - SMD/SMT; Termination Style: SMD/SMT; Case Code - mm: 0603; Maximum Operating Temperature: + 125 C; Length: 0.6 mm; Product: General Type MLCCs; Case Code - in: 0201; RoHS: RoHS Compliant; Minimum Operating Temperature: - 55 C; RoHS - Mouser: Y; Height: 0.3 mm; Packaging: Reel; Series: GRM; Reeling: True; Supplier 1: Digi-Key; Supplier Part Number 1: 490-12232-1-ND
FR11 = Ferrite: as FR34 on sheet 06_LMS7002M_Power; Supplier 1: Digi-Key; Package / Case: 0402 (1005 Metric); Category: Filters; Supplier Part Number 1: 445-9329-2-ND; Value: 220R, 0.9A
IC5 = 10M16SAU169C8G: Manufacturer: Altera; Part Description: IC FPGA/CPLD NV 130 I/O 169UBGA; Number of LABs/CLBs: 1000; Number of Logic Elements/Cells: 16000; Total RAM Bits: 562176; Number of I/O: 130; Voltage - Supply: 2.85 V ~ 3.465 V; Supplier 1: Digi-Key; RoHS: RoHS Compliant; Number of Gates: -; Mounting Type: Surface Mount; Operating Temperature: 0°C ~ 85°C (TJ); Package / Case: 169-LFBGA; Supplier Device Package: 169-UBGA (11x11); Category: Integrated Circuits (ICs); Manufacturer Part Number 1: 10M16SAU169C8G; Supplier Part Number 1: 544-3110-ND
J3 = Header7P: Header, 7-pin; Manufacturer: Sullins Connector Solutions; Manufacturer Part Number 1: PEC07SAAN; Part Description: 7 Positions Header, Unshrouded, Breakaway Connector 0.100" (2.54mm) Through Hole Tin; Number of Positions Loaded: All; Pitch: 0.100" (2.54mm); Number of Positions: 7; Connector Type: Header, Unshrouded, Breakaway; Supplier 1: Digi-Key; Color: Black; Packaging: Bulk; Category: Connectors, Interconnects; Contact Finish: Tin; Number of Rows: 1; RoHS: RoHS Compliant; Contact Type: Male Pin; Mounting Type: Through Hole; Features: -; Contact Mating Length: 0.230" (5.84mm); Termination: Solder; Fastening Type: -; Contact Finish Thickness: 100µin (2.54µm); Row Spacing: -; Supplier Part Number 1: S1012E-07-ND
J4 J5 = Header 5X2_SWD: Header, 5-Pin, Dual row; Manufacturer Part Number 1: M50-3600542; Manufacturer: Harwin Inc; Part Description: CONN HDR 1.27MM SMD AU 10POS; Number of Positions: 10; Molding Height Above Board: 0.039" (1.00mm); Row Spacing: 0.050" (1.27mm); Number of Positions Loaded: All; Connector Type: Unshrouded; Supplier 1: Digi-Key; Contact Mating Length: 0.118" (3.00mm); Category: Connectors, Interconnects; Color: Black; RoHS: RoHS Compliant; Number of Rows: 2; Contact Finish Thickness: 3µin (0.08µm); Height Stacking (Mating): -; Contact Finish: Gold; Termination: Solder; Mounting Type: Surface Mount; Pitch: 0.050" (1.27mm); Features: -; Packaging: Bulk; Supplier Part Number 1: 952-1389-ND
J6 = Header5P: Header, 5-pin; Manufacturer: Amphenol FCI; Manufacturer Part Number 1: 69190-405HLF; Part Description: 5 Positions Header Connector 0.100" (2.54mm) Through Hole Tin; Pitch - Mating: 0.100" (2.54mm); Style: Board to Board; Shrouding: Unshrouded; Number of Positions: 5; Number of Positions Loaded: All; Contact Length - Mating: 0.230" (5.84mm); Contact Length - Post: 0.120" (3.05mm); Overall Contact Length: 0.450" (11.43mm); Material Flammability Rating: UL94 V-0; Supplier 1: Digi-Key; Supplier Part Number 1: 609-4726-ND; RoHS: RoHS Compliant; Category: Connectors, Interconnects; Stock 1: 2326; Pricing 1: 1=0.28, 10=0.26, 100=0.1799, 500=0.15224, 1000=0.12456, 5000=0.11072, 10000=0.10034 (USD); Packaging: Bulk; Part Status: Active; Connector Type: Header; Contact Type: Male Pin; Number of Rows: 1; Row Spacing - Mating: -; Mounting Type: Through Hole; Termination: Press-Fit, Solder; Fastening Type: Push-Pull; Insulation Height: 0.100" (2.54mm); Contact Shape: Square; Contact Finish - Mating: Tin; Contact Finish Thickness - Mating: 100µin (2.54µm); Contact Finish - Post: Tin; Contact Material: Phosphor Bronze; Insulation Material: Polycyclohexylenedimethylene Terephthalate (PCT), Glass Filled; Features: -; Operating Temperature: -; Ingress Protection: -; Insulation Color: Black; Current Rating: -; Voltage Rating: -; Mated Stacking Heights: -; Contact Finish Thickness - Post: -; Applications: -; ComponentLink1URL: http://portal.fciconnect.com/Comergent//fci/drawing/69190.pdf; ComponentLink1Description: http://portal.fciconnect.com/Comergent//fci/drawing/69190.pdf
R34-R38 R45-R49 = Res_0402: as R89 on sheet 06_LMS7002M_Power; Value: 10k, 1%; Supplier 1: Digi-Key; Supplier Part Number 1: 311-10.0KLRTR-ND; Resistance (Ohms): 10k; Packaging: Tape & Reel (TR); RoHS: RoHS Compliant; Package / Case: 0402 (1005 Metric); Tolerance: ±1%; Operating Temperature: -55°C ~ 155°C; Size / Dimension: 0.039" L x 0.020" W (1.00mm x 0.50mm); Number of Terminations: 2; Category: Resistors; Height: 0.016" (0.40mm); Supplier Device Package: 0402; Features: Moisture Resistant; Composition: Thick Film
R39 = Res_0402: Manufacturer: Stackpole Electronics Inc; Manufacturer Part Number 1: RMCF0402FT1K00; Part Description: RES SMD 1K OHM 1% 1/16W 0402; Temperature Coefficient: ±100ppm/°C; Power (Watts): 0.063W, 1/16W; Value: 1k, 1%; Supplier 1: Digi-Key; Supplier Part Number 1: RMCF0402FT1K00TR-ND; Package / Case: 0402 (1005 Metric); Supplier Device Package: 0402; Height: 0.016" (0.40mm); Size / Dimension: 0.039" L x 0.020" W (1.00mm x 0.50mm); Number of Terminations: 2; Packaging: Cut Tape (CT); Category: Resistors; Composition: Thick Film; Resistance (Ohms): 1k; Tolerance: ±1%; Features: Moisture Resistant; Operating Temperature: -55°C ~ 155°C; RoHS: RoHS Compliant
R40 R41 = Res_0402: Manufacturer: Yageo; Part Description: RES SMD 0.0OHM JUMPER 1/16W 0402; Manufacturer Part Number 1: RC0402JR-070RL; Supplier 1: Digi-Key; Supplier Part Number 1: 311-0.0JRTR-ND; Composition: Thick Film; Package / Case: 0402 (1005 Metric); Category: Resistors; Value: 0R
R42-R44 = Res_0402: Manufacturer: Yageo; Part Description: RES SMD 0.0OHM JUMPER 1/16W 0402; Supplier 1: Digi-Key; Supplier Part Number 1: 311-0.0JRTR-ND; Composition: Thick Film; Package / Case: 0402 (1005 Metric); Category: Resistors; Value: 0R